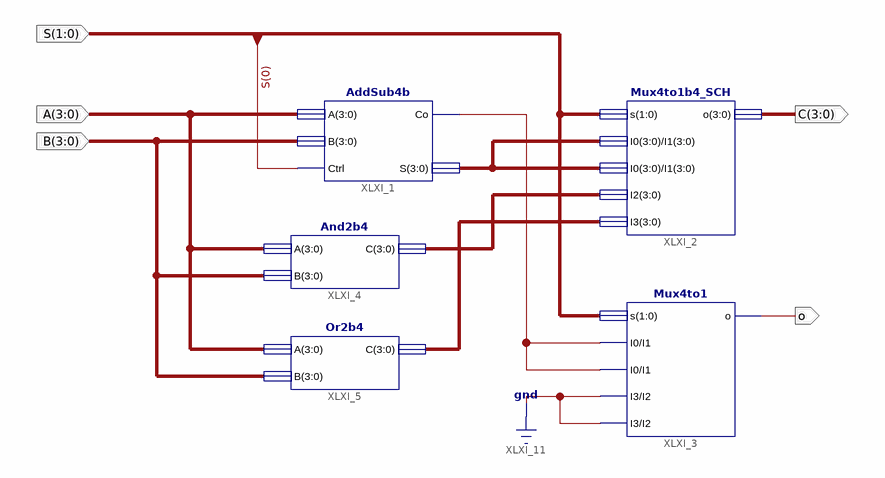
[diagram p0: schematic sheet 1]
// Xilinx ISE schematic myALU_SCH.sch (kintex7) as structural Verilog: 5 symbols, 5 ports
module myALU_SCH (
  input  [1:0] S,
  input  [3:0] B,
  input  [3:0] A,
  output [3:0] C,
  output o
);

  wire XLXN_4;
  wire [3:0] XLXN_6, XLXN_8, XLXN_13;

  Mux4to1b4_SCH XLXI_2 (.s(S), .I0(XLXN_6), .I1(XLXN_6), .I2(XLXN_13), .I3(XLXN_8), .o(C));
  Mux4to1 XLXI_3 (.s(S), .I0(XLXN_4), .I1(XLXN_4), .I3(1'b0), .I2(1'b0), .o(o));
  AddSub4b XLXI_1 (.A(A), .B(B), .Ctrl(S[0]), .Co(XLXN_4), .S(XLXN_6));
  Or2b4 XLXI_5 (.A(A), .B(B), .C(XLXN_8));
  And2b4 XLXI_4 (.A(A), .B(B), .C(XLXN_13));
endmodule
